# EAGLE design LED_board (EAGLE 8.5.2)
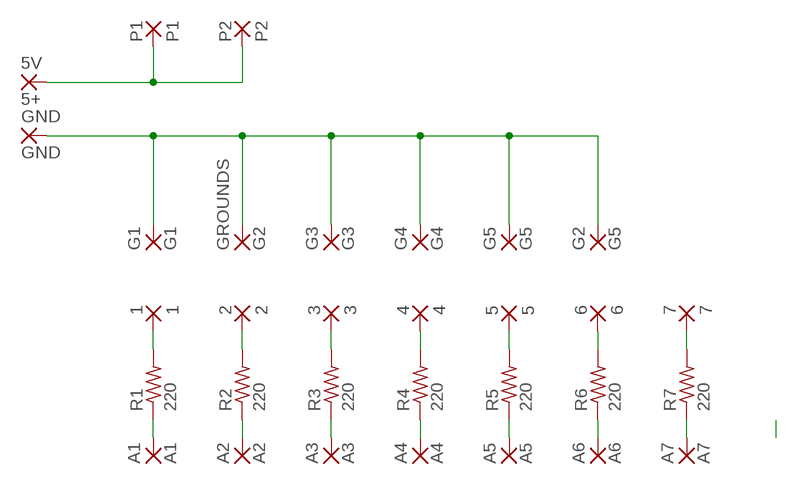
[diagram p0: schematic, sheet 1]

## Parts
1  1  2,15/1,0  [2,15/1,0]
2  2  2,15/1,0  [2,15/1,0]
3  3  2,15/1,0  [2,15/1,0]
4  4  2,15/1,0  [2,15/1,0]
5  5  2,15/1,0  [2,15/1,0]
5V  5+  2,54/1,1  [2,54/1,1]
6  6  2,15/1,0  [2,15/1,0]
7  7  2,15/1,0  [2,15/1,0]
A1  A1  2,15/1,0  [2,15/1,0]
A2  A2  2,15/1,0  [2,15/1,0]
A3  A3  2,15/1,0  [2,15/1,0]
A4  A4  2,15/1,0  [2,15/1,0]
A5  A5  2,15/1,0  [2,15/1,0]
A6  A6  2,15/1,0  [2,15/1,0]
A7  A7  2,15/1,0  [2,15/1,0]
G1  G1  2,15/1,0  [2,15/1,0]
G2  G5  2,15/1,0  [2,15/1,0]
G3  G3  2,15/1,0  [2,15/1,0]
G4  G4  2,15/1,0  [2,15/1,0]
G5  G5  2,15/1,0  [2,15/1,0]
GND  GND  2,54/1,1  [2,54/1,1]
GROUNDS  G2  2,15/1,0  [2,15/1,0]
P1  P1  2,15/1,0  [2,15/1,0]
P2  P2  2,15/1,0  [2,15/1,0]
R1  220  R-US_0207/10  [0207/10]
R2  220  R-US_0207/10  [0207/10]
R3  220  R-US_0207/10  [0207/10]
R4  220  R-US_0207/10  [0207/10]
R5  220  R-US_0207/10  [0207/10]
R6  220  R-US_0207/10  [0207/10]
R7  220  R-US_0207/10  [0207/10]

## Nets
N$1: 5V.1(P) P1.1(P) P2.1(P)
N$2: 1.1(P) R1.2
N$3: A1.1(P) R1.1
N$4: G1.1(P) G2.1(P) G3.1(P) G4.1(P) G5.1(P) GND.1(P) GROUNDS.1(P)
N$5: 2.1(P) R2.2
N$6: A2.1(P) R2.1
N$7: A3.1(P) R3.1
N$8: 3.1(P) R3.2
N$9: 4.1(P) R4.2
N$10: A4.1(P) R4.1
N$11: A5.1(P) R5.1
N$12: 5.1(P) R5.2
N$13: 6.1(P) R6.2
N$14: A6.1(P) R6.1
N$15: A7.1(P) R7.1
N$16: 7.1(P) R7.2

## Library data of the parts
1-7 A1-A7 G1-G5 GROUNDS P1 P2 = wirepad:2,15/1,0: THROUGH-HOLE PAD
5V GND = wirepad:2,54/1,1: THROUGH-HOLE PAD
R1-R7 = resistor:R-US_: RESISTOR, American symbol

## Board
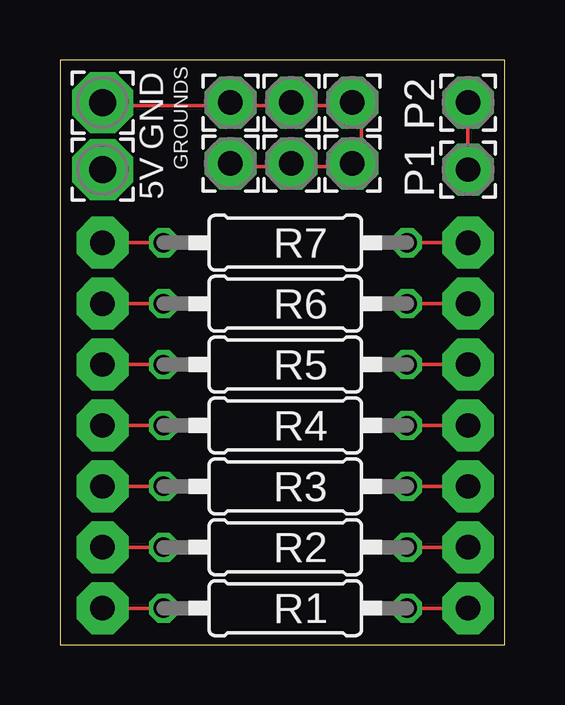
[diagram p1: board, top side]
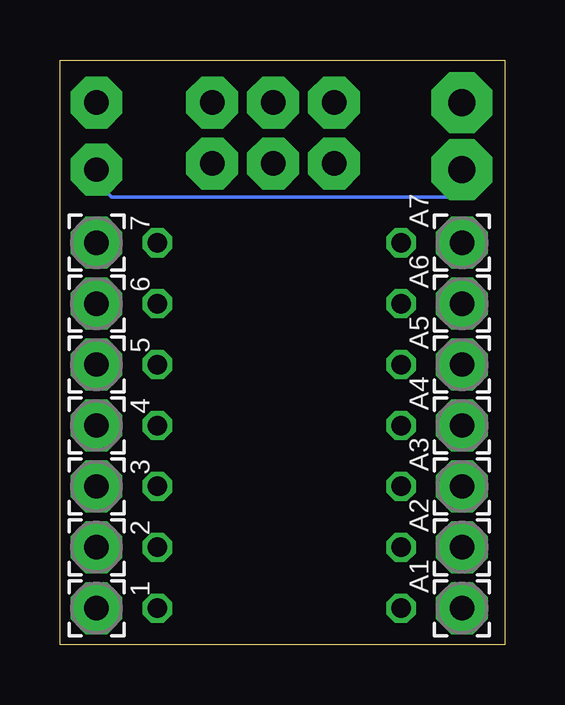
[diagram p2: board, bottom side, seen from below]

Size 18.54 x 24.38 mm. Coordinates in mm from the lower left corner, seen from the top.
Outline: 0,0 18.54,0 18.54,24.38 0,24.38 0,0
Copper layers (1*16): Top 0.0356mm / dielectric 1.5011mm / Bottom 0.0356mm
Design rules "oshpark-2layer": minimum track width 6mil, minimum drill 13mil, track to track 6mil, track to pad 6mil, pad to pad 6mil, via to via 6mil, smd to smd 6mil, copper to edge 15mil, drill to drill 6mil, minimum pad ring 7mil, minimum via ring 7mil, stop-mask expansion 2.5mil, vias tented up to drill 0mil, thermal gap 10mil

### Footprints (pad centres in the part's own frame; a part is rotated, then mirrored left to right if it is on the bottom)
2,15/1,0 = drill 1.016 pad 2.159 octagon: 1 0,0
2,54/1,1 = drill 1.118 pad 2.54 octagon: 1 0,0
0207/10 = drill 0.813 octagon: 1 -5.08,0; 2 5.08,0

### Placement (x,y rotation side)
1  17.02,1.52 270 bottom
2  17.02,4.06 270 bottom
3  17.02,6.6 270 bottom
4  17.02,9.14 270 bottom
5  17.02,11.68 270 bottom
5V  1.78,19.81 270 top
6  17.02,14.22 270 bottom
7  17.02,16.76 270 bottom
A1  1.78,1.52 90 bottom
A2  1.78,4.06 90 bottom
A3  1.78,6.6 90 bottom
A4  1.78,9.14 90 bottom
A5  1.78,11.68 90 bottom
A6  1.78,14.22 90 bottom
A7  1.78,16.76 90 bottom
G1  9.65,22.61 90 top
G2  12.19,20.07 0 top
G3  12.19,22.61 90 top
G4  7.11,22.61 90 top
G5  9.65,20.07 90 top
GND  1.78,22.61 270 top
GROUNDS  7.11,20.07 90 top
P1  17.02,19.81 90 top
P2  17.02,22.61 90 top
R1  9.4,1.52 0 top
R2  9.4,4.06 0 top
R3  9.4,6.6 0 top
R4  9.4,9.14 0 top
R5  9.4,11.68 0 top
R6  9.4,14.22 0 top
R7  9.4,16.76 0 top

### Tracks (layer width: path | path; a pad name or v marks a point on that pad's centre or on a via)
N$1
  Top 0.152: P2.1 P1.1
  Bottom 0.152: 5V.1 1.78,19.3 2.41,18.67 16.38,18.67 17.02,19.3 P1.1
N$2
  Top 0.152: 1.1 R1.2
N$3
  Top 0.152: A1.1 R1.1
N$4
  Top 0.152: GROUNDS.1 7.49,19.94 9.4,19.94 G5.1 10.03,19.94 11.94,19.94 G2.1 12.57,20.57 12.57,22.48 G3.1 11.94,22.48 10.03,22.48 G1.1 9.4,22.48 7.49,22.48 G4.1 6.86,22.48 1.78,22.48 GND.1
N$5
  Top 0.152: 2.1 R2.2
N$6
  Top 0.152: A2.1 R2.1
N$7
  Top 0.152: A3.1 R3.1
N$8
  Top 0.152: 3.1 R3.2
N$9
  Top 0.152: 4.1 R4.2
N$10
  Top 0.152: A4.1 R4.1
N$11
  Top 0.152: A5.1 R5.1
N$12
  Top 0.152: 5.1 R5.2
N$13
  Top 0.152: 6.1 R6.2
N$14
  Top 0.152: A6.1 R6.1
N$15
  Top 0.152: A7.1 R7.1
N$16
  Top 0.152: 7.1 R7.2